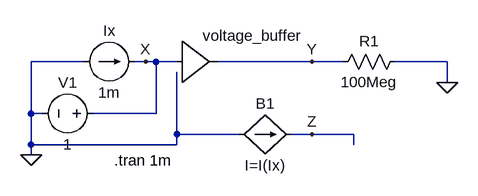
[diagram p0: schematic current_conveyor.asc]
current_conveyor.asc, the LTspice schematic file:
Version 4
SHEET 1 880 680
WIRE 16 160 -64 160
WIRE 112 160 96 160
WIRE 128 160 112 160
WIRE 160 160 128 160
WIRE 368 160 224 160
WIRE 416 160 368 160
WIRE 576 160 496 160
WIRE 576 192 576 160
WIRE -64 240 -64 160
WIRE -48 240 -64 240
WIRE 128 240 128 160
WIRE 128 240 32 240
WIRE 160 272 160 176
WIRE 256 272 160 272
WIRE 368 272 336 272
WIRE 432 272 368 272
WIRE -64 288 -64 240
WIRE 160 288 160 272
WIRE 160 288 -64 288
WIRE 432 288 432 272
WIRE -64 304 -64 288
FLAG -64 304 0
FLAG 368 160 Y
FLAG 368 272 Z
FLAG 576 192 0
FLAG 112 160 X
SYMBOL Digital\\buf1 160 96 R0
SYMATTR InstName voltage_buffer
SYMBOL current 16 160 R270
WINDOW 0 32 40 VTop 2
WINDOW 3 -32 40 VBottom 2
WINDOW 123 0 0 Left 2
WINDOW 39 0 0 Left 2
SYMATTR InstName Ix
SYMATTR Value 1m
SYMBOL bi 256 272 R270
WINDOW 0 32 40 VTop 2
WINDOW 3 -32 40 VBottom 2
SYMATTR InstName B1
SYMATTR Value I=I(Ix)
SYMBOL res 400 176 R270
WINDOW 0 32 56 VTop 2
WINDOW 3 0 56 VBottom 2
SYMATTR InstName R1
SYMATTR Value 100Meg
SYMBOL voltage 48 240 R90
WINDOW 0 -32 56 VBottom 2
WINDOW 3 32 56 VTop 2
WINDOW 123 0 0 Left 2
WINDOW 39 0 0 Left 2
SYMATTR InstName V1
SYMATTR Value 1
TEXT 64 312 Left 2 !.tran 1m

The netlist it stands for:
* current_conveyor.asc
A§voltage_buffer X 0 0 0 0 0 Y 0 BUF
Ix 0 X 1m
B1 0 Z I=I(Ix)
R1 Y 0 100Meg
V1 X 0 1
.tran 1m
.backanno
.end